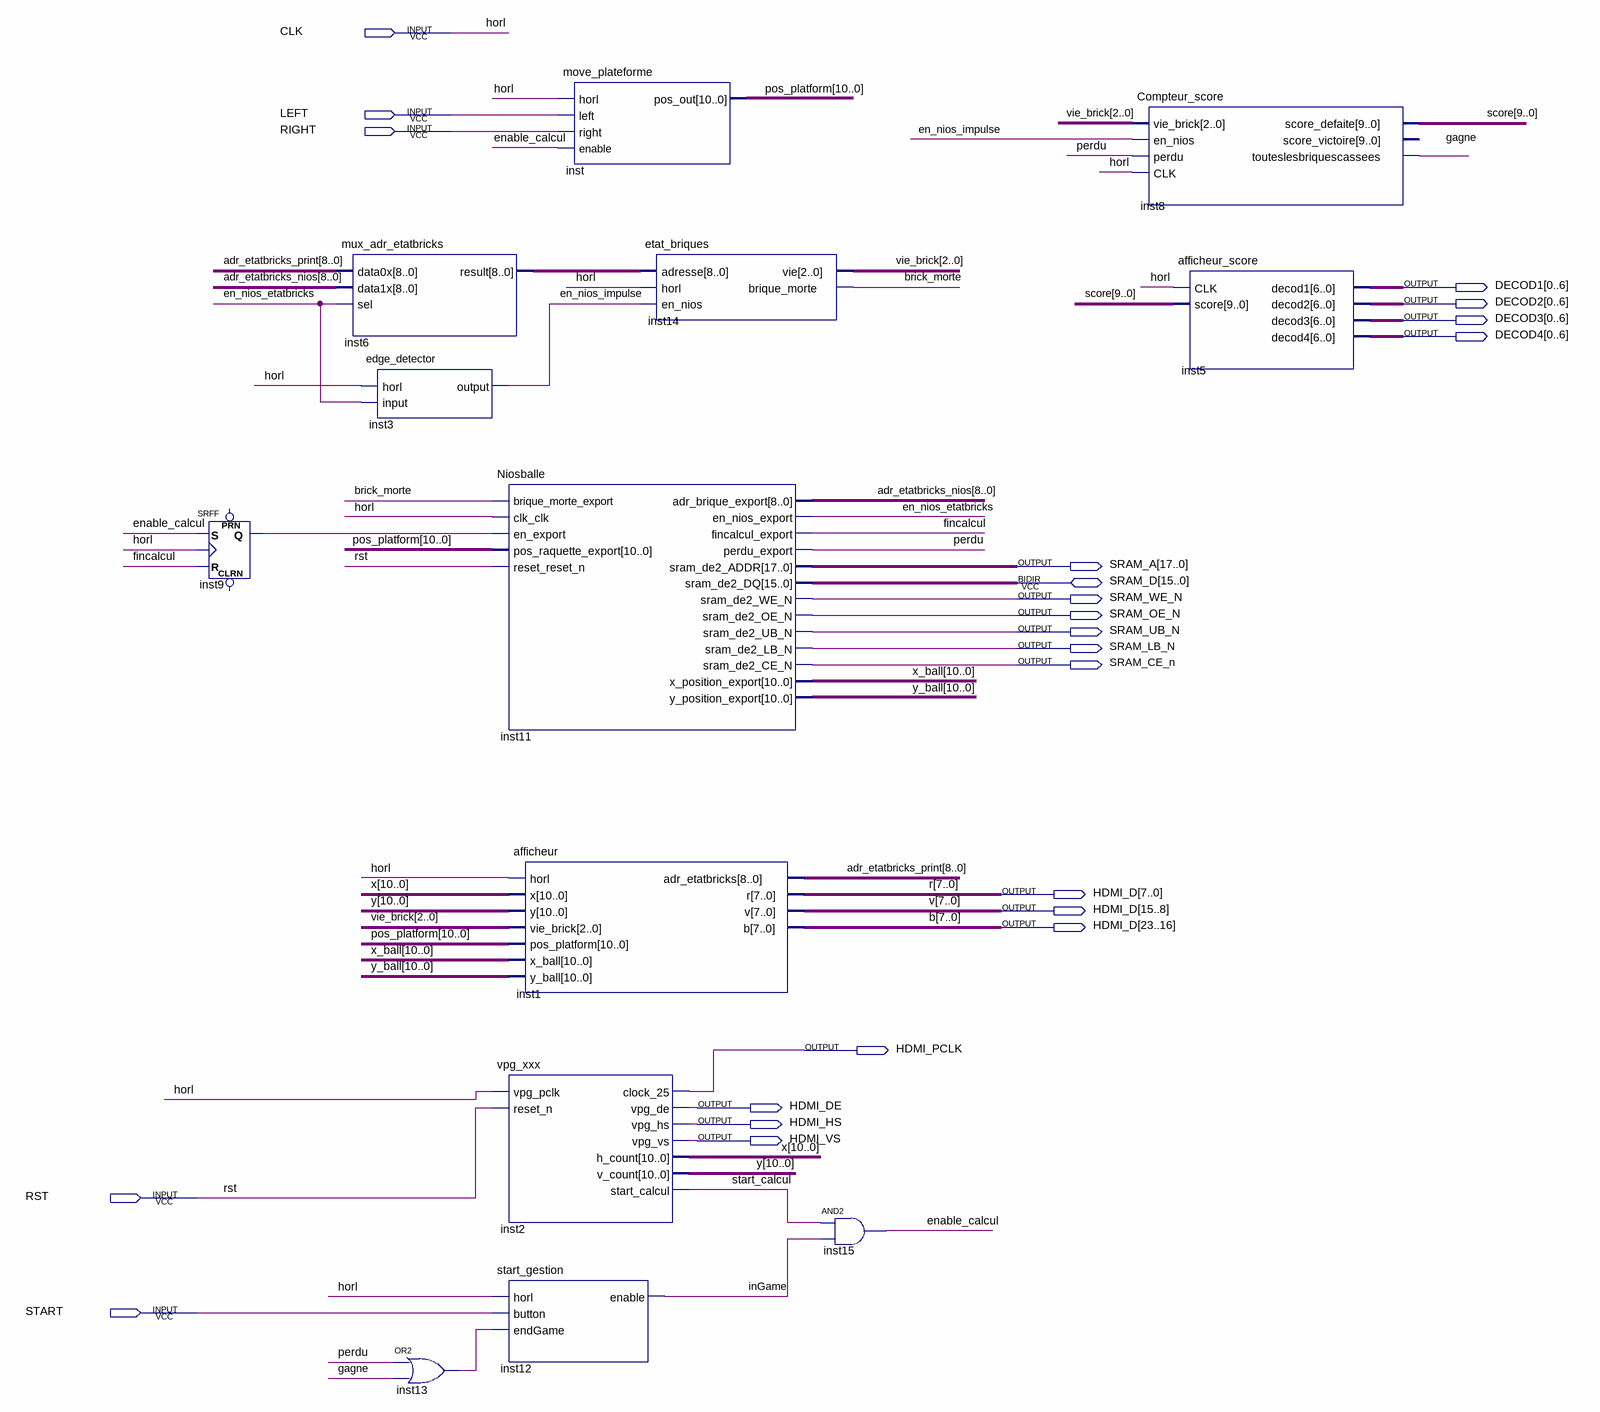
[diagram p0: schematic sheet]
// Quartus schematic main (2).bdf as structural Verilog: 13 symbols, 23 pins
module \main_(2)  (
  input  CLK,
  input  LEFT,
  input  RIGHT,
  input  RST,
  input  START,
  inout  [15:0] SRAM_D,
  output [0:6] DECOD1,
  output [0:6] DECOD2,
  output [0:6] DECOD3,
  output [0:6] DECOD4,
  output [17:0] SRAM_A,
  output SRAM_WE_N,
  output SRAM_OE_N,
  output SRAM_UB_N,
  output SRAM_LB_N,
  output SRAM_CE_n,
  output [23:0] HDMI_D,
  output HDMI_PCLK,
  output HDMI_DE,
  output HDMI_HS,
  output HDMI_VS
);

  wire brick_morte, en_nios_etatbricks, en_nios_impulse, enable_calcul, fincalcul, gagne, inGame, inst9_q,
       inst13_out, perdu, start_calcul;
  wire [2:0] vie_brick;
  wire [8:0] adr_etatbricks_nios, adr_etatbricks_print, inst6_result;
  wire [9:0] score;
  wire [10:0] pos_platform, x, x_ball, y, y_ball;

  SRFF inst9 (.S(enable_calcul), .R(fincalcul), .CLK(CLK), .Q(inst9_q));  // open: PRN, CLRN
  mux_adr_etatbricks inst6 (
    .data0x(adr_etatbricks_print), .data1x(adr_etatbricks_nios), .sel(en_nios_etatbricks),
    .result(inst6_result));
  edge_detector inst3 (.horl(CLK), .\input (en_nios_etatbricks), .\output (en_nios_impulse));
  or inst13 (inst13_out, perdu, gagne);
  Niosballe inst11 (
    .brique_morte_export(brick_morte), .clk_clk(CLK), .en_export(inst9_q),
    .pos_raquette_export(pos_platform), .reset_reset_n(RST), .adr_brique_export(adr_etatbricks_nios),
    .en_nios_export(en_nios_etatbricks), .fincalcul_export(fincalcul), .perdu_export(perdu),
    .sram_de2_ADDR(SRAM_A), .sram_de2_WE_N(SRAM_WE_N), .sram_de2_OE_N(SRAM_OE_N), .sram_de2_UB_N(SRAM_UB_N),
    .sram_de2_LB_N(SRAM_LB_N), .sram_de2_CE_N(SRAM_CE_n), .x_position_export(x_ball),
    .y_position_export(y_ball), .sram_de2_DQ(SRAM_D));
  afficheur inst1 (
    .horl(CLK), .x(x), .y(y), .vie_brick(vie_brick), .pos_platform(pos_platform), .x_ball(x_ball),
    .y_ball(y_ball), .adr_etatbricks(adr_etatbricks_print), .r(HDMI_D[7:0]), .v(HDMI_D[15:8]),
    .b(HDMI_D[23:16]));
  vpg_xxx inst2 (
    .vpg_pclk(CLK), .reset_n(RST), .clock_25(HDMI_PCLK), .vpg_de(HDMI_DE), .vpg_hs(HDMI_HS),
    .vpg_vs(HDMI_VS), .h_count(x), .v_count(y), .start_calcul(start_calcul));
  start_gestion inst12 (.horl(CLK), .button(START), .endGame(inst13_out), .enable(inGame));
  move_plateforme inst (.horl(CLK), .left(LEFT), .right(RIGHT), .enable(enable_calcul), .pos_out(pos_platform));
  etat_briques inst14 (
    .adresse(inst6_result), .horl(CLK), .en_nios(en_nios_impulse), .vie(vie_brick), .brique_morte(brick_morte));
  and inst15 (enable_calcul, start_calcul, inGame);
  Compteur_score inst8 (
    .vie_brick(vie_brick), .en_nios(en_nios_impulse), .perdu(perdu), .CLK(CLK), .score_defaite(score),
    .touteslesbriquescassees(gagne));  // open: score_victoire
  afficheur_score inst5 (.CLK(CLK), .score(score), .decod1(DECOD1), .decod2(DECOD2), .decod3(DECOD3), .decod4(DECOD4));

  // Other names for the same wires on the sheet: b[7:0] = HDMI_D[23:16]; horl = CLK; r[7:0] = HDMI_D[7:0];
  //   v[7:0] = HDMI_D[15:8]
endmodule
